# Altium project STM32_development_board.PrjPcb
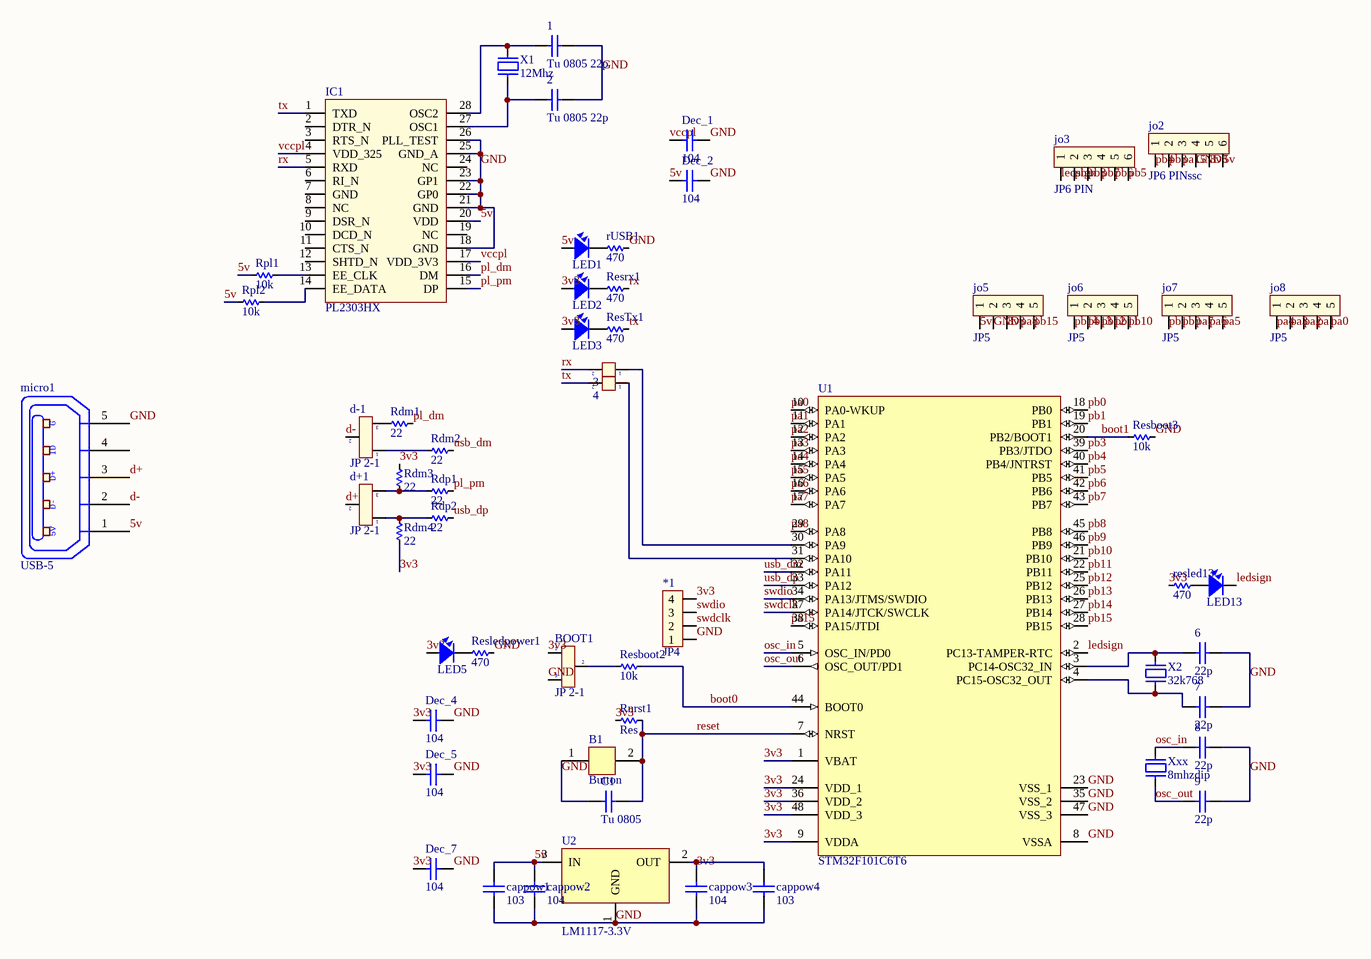
[diagram p0: Sheet1.SchDoc]
1 sheet, 57 parts. Net scope: global (net labels, ports and power ports of the same name join across sheets).
Board file: PCB1.PcbDoc

## Sheet Sheet1.SchDoc
size A0

### Parts
1  Tu 0805 22p  [Tu 0805]
2  Tu 0805 22p  [Tu 0805]
3  Jumper 2  [JP2]  (value not drawn)
4  Jumper 2  [JP2]  (value not drawn)
6  22p  [Tu 0805]
7  22p  [Tu 0805]
8  22p  [Tu 0805]
9  22p  [Tu 0805]
*1  JP4  [JP4]
B1  Button  [Button 2 Pin]
BOOT1  JP 2-1  [JP3]
C1  Tu 0805  [Tu 0805]
cappow1  103  [Tu 0805]
cappow2  104  [Tu 0805]
cappow3  104  [Tu 0805]
cappow4  103  [Tu 0805]
d+1  JP 2-1  [JP3]
d-1  JP 2-1  [JP3]
Dec_1  104  [Tu 0805]
Dec_2  104  [Tu 0805]
Dec_4  104  [Tu 0805]
Dec_5  104  [Tu 0805]
Dec_7  104  [Tu 0805]
IC1  PL2303HX  [SO-G28/C6.8]
jo2  JP6 PINssc  [JP6]
jo3  JP6 PIN  [JP6]
jo5  JP5  [JP5]
jo6  JP5  [JP5]
jo7  JP5  [JP5]
jo8  JP5  [JP5]
LED1  LED SMD  [SM-LED-0805-Blue]  (value not drawn)
LED2  LED SMD  [SM-LED-0805-Blue]  (value not drawn)
LED3  LED SMD  [SM-LED-0805-Blue]  (value not drawn)
LED5  LED SMD  [SM-LED-0805-Blue]  (value not drawn)
LED13  LED SMD  [SM-LED-0805-Blue]  (value not drawn)
micro1  USB-5  [USB-M1]
Rdm1  22  [RES-SMD-0805]
Rdm2  22  [RES-SMD-0805]
Rdm3  22  [RES-SMD-0805]
Rdm4  22  [RES-SMD-0805]
Rdp1  22  [RES-SMD-0805]
Rdp2  22  [RES-SMD-0805]
Resboot2  10k  [RES-SMD-0805]
Resboot3  10k  [RES-SMD-0805]
resled13  470  [RES-SMD-0805]
Resledpower1  470  [RES-SMD-0805]
Resrx1  470  [RES-SMD-0805]
ResTx1  470  [RES-SMD-0805]
Rnrst1  Res  [RES-SMD-0805]
Rpl1  10k  [RES-SMD-0805]
Rpl2  10k  [RES-SMD-0805]
rUSB1  470  [RES-SMD-0805]
U1  STM32F101C6T6  [TQFP48]
U2  LM1117-3.3V  [LM1117-SOP]
X1  12Mhz  [XT2-SMD]
X2  32k768  [XT32k]
Xxx  8mhzdip  [XT2]

### Nets
3v3: *1.4 BOOT1.1 cappow3.2 cappow4.2 Dec_4.1 Dec_5.1 Dec_7.1 jo2.5 jo5.3 LED2.1 LED3.1 LED5.1 Rdm3.1 Rdm4.2 resled13.2 Rnrst1.2 U1.1(VBAT) U1.9(VDDA) U1.24(VDD_1) U1.36(VDD_2) U1.48(VDD_3) U2.2(OUT)
5v: cappow1.2 cappow2.2 Dec_2.1 IC1.20(VDD) jo2.6 jo5.1 LED1.1 micro1.1(P1) Rpl1.2 Rpl2.2 U2.3(IN)
boot0: Resboot2.1 U1.44(BOOT0)
boot1: Resboot3.2 U1.20(PB2/BOOT1)
d+: d+1.2 micro1.3(P3)
d-: d-1.2 micro1.2(P2)
GND: 1.2 2.2 6.2 7.2 8.2 9.2 *1.1 B1.1 BOOT1.3 C1.2 cappow1.1 cappow2.1 cappow3.1 cappow4.1 Dec_1.1 Dec_2.2 Dec_4.2 Dec_5.2 Dec_7.2 IC1.18(GND) IC1.21(GND) IC1.22(GP0) IC1.23(GP1) IC1.25(GND_A) IC1.26(PLL_TEST) jo2.4 jo5.2 micro1.5(P5) Resboot3.1 Resledpower1.1 rUSB1.1 U1.8(VSSA) U1.23(VSS_1) U1.35(VSS_2) U1.47(VSS_3) U2.1(GND)
ledsign: jo3.1 LED13.2 U1.2(PC13-TAMPER-RTC)
osc_in: 8.1 U1.5(OSC_IN/PD0) Xxx.2
osc_out: 9.1 U1.6(OSC_OUT/PD1) Xxx.1
pa0: jo8.5 U1.10(PA0-WKUP)
pa1: jo8.4 U1.11(PA1)
pa2: jo8.3 U1.12(PA2)
pa3: jo8.2 U1.13(PA3)
pa4: jo8.1 U1.14(PA4)
pa5: jo7.5 U1.15(PA5)
pa6: jo7.4 U1.16(PA6)
pa7: jo7.3 U1.17(PA7)
pa8: jo5.4 U1.29(PA8)
pa15: jo2.3 U1.38(PA15/JTDI)
pb0: jo7.2 U1.18(PB0)
pb1: jo7.1 U1.19(PB1)
pb3: jo2.2 U1.39(PB3/JTDO)
pb4: jo2.1 U1.40(PB4/JNTRST)
pb5: jo3.6 U1.41(PB5)
pb6: jo3.5 U1.42(PB6)
pb7: jo3.4 U1.43(PB7)
pb8: jo3.3 U1.45(PB8)
pb9: jo3.2 U1.46(PB9)
pb10: jo6.5 U1.21(PB10)
pb11: jo6.4 U1.22(PB11)
pb12: jo6.3 U1.25(PB12)
pb13: jo6.2 U1.26(PB13)
pb14: jo6.1 U1.27(PB14)
pb15: jo5.5 U1.28(PB15)
pl_dm: IC1.16(DM) Rdm1.1
pl_pm: IC1.15(DP) Rdp1.1
reset: B1.2 C1.1 Rnrst1.1 U1.7(NRST)
rx: 3.2 IC1.5(RXD) Resrx1.1
swdclk: *1.2 U1.37(PA14/JTCK/SWCLK)
swdio: *1.3 U1.34(PA13/JTMS/SWDIO)
tx: 4.2 IC1.1(TXD) ResTx1.1
usb_dm: Rdm2.1 U1.32(PA11)
usb_dp: Rdp2.1 U1.33(PA12)
vccpl: Dec_1.2 IC1.4(VDD_325) IC1.17(VDD_3V3)
Net1_1: 1.1 IC1.28(OSC2) X1.2
Net2_1: 2.1 IC1.27(OSC1) X1.1
Net3_1: 3.1 U1.30(PA9)
Net4_1: 4.1 U1.31(PA10)
Net6_1: 6.1 U1.3(PC14-OSC32_IN) X2.1
Net7_1: 7.1 U1.4(PC15-OSC32_OUT) X2.2
NetBOOT1_2: BOOT1.2 Resboot2.2
Netd+1_1: d+1.1 Rdm4.1 Rdp2.2
Netd+1_3: d+1.3 Rdm3.2 Rdp1.2
Netd-1_1: d-1.1 Rdm2.2
Netd-1_3: d-1.3 Rdm1.2
NetIC1_13: IC1.13(EE_CLK) Rpl1.1
NetIC1_14: IC1.14(EE_DATA) Rpl2.1
NetLED1_2: LED1.2 rUSB1.2
NetLED2_2: LED2.2 Resrx1.2
NetLED3_2: LED3.2 ResTx1.2
NetLED5_2: LED5.2 Resledpower1.2
NetLED13_1: LED13.1 resled13.1

Not connected (* = marked no-connect by the designer): IC1 2(DTR_N) 3(RTS_N) 6(RI_N) 7(GND) 8(NC) 9(DSR_N) 10(DCD_N) 11(CTS_N) 12(SHTD_N) 19(NC) 24(NC); micro1 4(P4)

### Notes on the sheet
- (in symbol USB-5) G; ID; D+; D-; 5V

### Library data of the parts
1 2 6-9 C1 cappow1-cappow4 Dec_1 Dec_2 Dec_4 Dec_5 Dec_7 = CAP 0805
3 4 = JP 2: Value: JP 2
B1 = Button 2 Pin
BOOT1 d+1 d-1 = JP 2-1_1: Jumper 2-1; Value: J2-1
IC1 = PL2303HX: USB - RS232 Converter; Value: PL2303
jo2 = JP6: JP6 PIN; Value: JP7
jo3 = JP6: Value: JP7
LED1-LED3 LED5 LED13 = LED-SMD-0805
micro1 = USB-5: Manufacturer: FCI; Manufacturer Part Number: 10118193-0001LF; Connector Type: USB - micro B; Number of Contacts: 5; Gender: Receptacle; Specifications: USB 2.0; .Creator: MM; .Checked PCB: RF; Supplier 1: Digi-Key; RoHS: RoHS Compliant; Category: Connectors, Interconnects; Stock 1: 28642; Pricing 1: 1=0.46, 10=0.433, 25=0.3712, 50=0.3156, 100=0.3032, 250=0.27224, 500=0.25988 (USD); Packaging: Cut Tape (CT); Mounting Type: Surface Mount, Right Angle, Horizontal; Features: Shielded, Solder Retention; Ingress Protection: -; ComponentLink1URL: http://portal.fciconnect.com/Comergent//fci/drawing/10118193.pdf; ComponentLink1Description: http://portal.fciconnect.com/Comergent//fci/drawing/10118193.pdf; Supplier Part Number 1: 609-4616-1-ND; .Checked SCH: MM
Rdm1-Rdm4 Rdp1 Rdp2 Resboot2 Resboot3 resled13 Resledpower1 Resrx1 ResTx1 Rnrst1 Rpl1 Rpl2 rUSB1 = Res-SMD: Resistor; Manufacturer: Generic Components; Class: Passive; Published: 08/06/2000; Publisher: Altium Hobart Technology Centre
U1 = STM32F101C6T6: STM32 ARM-based 32-bit MCU with 32 Kbytes Flash, 48-pin LQFP, Industrial Temperature; Published: 30-May-2008; DatasheetVersion: rev6, Mar-2008; PackageVersion: Mar-2008; PackageReference: LQFP48; Publisher: Altium Limited; PackageDescription: 48-Pin Low-Profile Quad Flat Pack, 7 x 7 mm Body, 0.5 mm Pitch (LQFP48); ComponentLink1Description: Manufacturer Link; ComponentLink1URL: www.st.com/stm32; ComponentLink2Description: Datasheet; ComponentLink2URL: http://www.st.com/stonline/products/literature/ds/13586.pdf
U2 = LM1117: 800mA Low-Dropout Linear Regulator; Creator: Nguyen Ba Bien; Website: http://group3i.net
X1 X2 = XT2: Crystal, 32.768 KHz, -40 to 85 degC, 3.2 x 1.5 x 0.9 mm SMD; Value: 4Mhz
Xxx = XT2: Crystal For all Crystal 2pin.; Value: 4Mhz